# Altium project LightLink_V4.PrjPcb
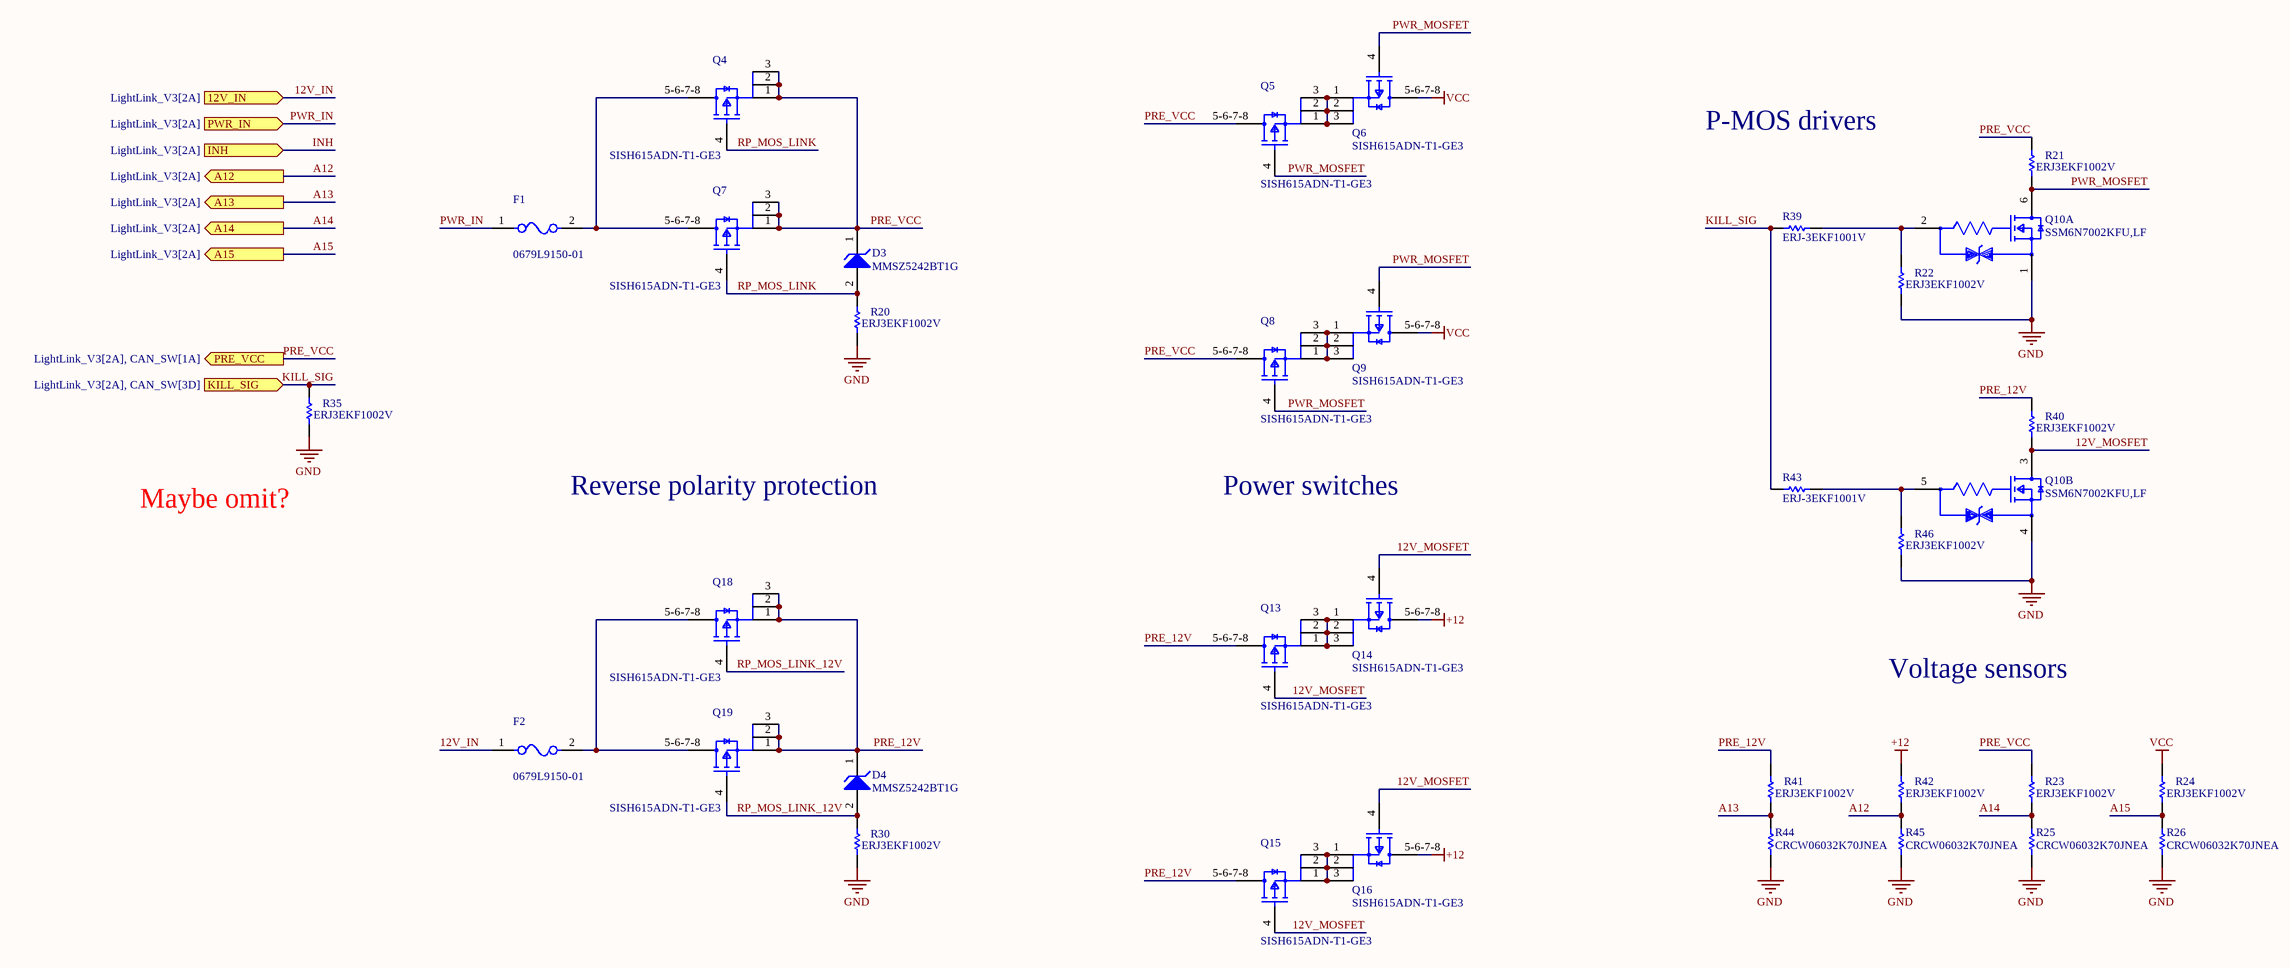
[diagram p0: PWR_MGMT.SchDoc]
1 sheet, 34 parts. Net scope: flat (ports and power ports of the same name join across sheets).
Board file: LightLink_V4.PcbDoc

## Sheet PWR_MGMT.SchDoc
size C; SheetNumber: 4; SheetTotal: 6

### Parts
D3  MMSZ5242BT1G  [ONSC-SOD-123-2-425-04_V]
D4  MMSZ5242BT1G  [ONSC-SOD-123-2-425-04_V]
F1  0679L9150-01  [FP-0679L-MFG]
F2  0679L9150-01  [FP-0679L-MFG]
Q4  SISH615ADN-T1-GE3  [SISH615ADN-T1-GE3-Footprint-1]
Q5  SISH615ADN-T1-GE3  [SISH615ADN-T1-GE3-Footprint-1]
Q6  SISH615ADN-T1-GE3  [SISH615ADN-T1-GE3-Footprint-1]
Q7  SISH615ADN-T1-GE3  [SISH615ADN-T1-GE3-Footprint-1]
Q8  SISH615ADN-T1-GE3  [SISH615ADN-T1-GE3-Footprint-1]
Q9  SISH615ADN-T1-GE3  [SISH615ADN-T1-GE3-Footprint-1]
Q10  SSM6N7002KFU,LF  [FP-SSOP6-P-0_65A-MFG]  (parts A,B of 2)
Q13  SISH615ADN-T1-GE3  [SISH615ADN-T1-GE3-Footprint-1]
Q14  SISH615ADN-T1-GE3  [SISH615ADN-T1-GE3-Footprint-1]
Q15  SISH615ADN-T1-GE3  [SISH615ADN-T1-GE3-Footprint-1]
Q16  SISH615ADN-T1-GE3  [SISH615ADN-T1-GE3-Footprint-1]
Q18  SISH615ADN-T1-GE3  [SISH615ADN-T1-GE3-Footprint-1]
Q19  SISH615ADN-T1-GE3  [SISH615ADN-T1-GE3-Footprint-1]
R20  ERJ3EKF1002V  [RESC1609X55X30LL15T15]
R21  ERJ3EKF1002V  [RESC1609X55X30LL15T15]
R22  ERJ3EKF1002V  [RESC1609X55X30LL15T15]
R23  ERJ3EKF1002V  [RESC1609X55X30LL15T15]
R24  ERJ3EKF1002V  [RESC1609X55X30LL15T15]
R25  CRCW06032K70JNEA  [RESC1609X50X30ML10T20]
R26  CRCW06032K70JNEA  [RESC1609X50X30ML10T20]
R30  ERJ3EKF1002V  [RESC1609X55X30LL15T15]
R35  ERJ3EKF1002V  [RESC1609X55X30LL15T15]
R39  ERJ-3EKF1001V  [RESC1608X55X30LL15T15]
R40  ERJ3EKF1002V  [RESC1609X55X30LL15T15]
R41  ERJ3EKF1002V  [RESC1609X55X30LL15T15]
R42  ERJ3EKF1002V  [RESC1609X55X30LL15T15]
R43  ERJ-3EKF1001V  [RESC1608X55X30LL15T15]
R44  CRCW06032K70JNEA  [RESC1609X50X30ML10T20]
R45  CRCW06032K70JNEA  [RESC1609X50X30ML10T20]
R46  ERJ3EKF1002V  [RESC1609X55X30LL15T15]

### Ports
12V_IN (in, see LightLink_V3[2A]), A12 (out, see LightLink_V3[2A]), A13 (out, see LightLink_V3[2A]), A14 (out, see LightLink_V3[2A]), A15 (out, see LightLink_V3[2A]), INH (in, see LightLink_V3[2A]), KILL_SIG (in, see LightLink_V3[2A], CAN_SW[3D]), PRE_VCC (out, see LightLink_V3[2A], CAN_SW[1A]), PWR_IN (in, see LightLink_V3[2A])

### Nets
+12: Q14.5-6-7-8(D) Q16.5-6-7-8(D) R42.1
GND: Q10.1(Source1) Q10.4(Source2) R20.2 R22.2 R25.1 R26.1 R30.2 R35.2 R44.1 R45.1 R46.2
VCC: Q6.5-6-7-8(D) Q9.5-6-7-8(D) R24.1
12V_IN: F2.1 ; port 12V_IN
12V_MOSFET: Q10.3(Drain2) Q13.4(G) Q14.4(G) Q15.4(G) Q16.4(G) R40.2
A12: R42.2 R45.2 ; port A12
A13: R41.2 R44.2 ; port A13
A14: R23.2 R25.2 ; port A14
A15: R24.2 R26.2 ; port A15
INH: port INH
KILL_SIG: R35.1 R39.1 R43.1 ; port KILL_SIG
PRE_12V: D4.1(K) Q13.5-6-7-8(D) Q15.5-6-7-8(D) Q18.1(S) Q18.2(S) Q18.3(S) Q19.1(S) Q19.2(S) Q19.3(S) R40.1 R41.1
PRE_VCC: D3.1(K) Q4.1(S) Q4.2(S) Q4.3(S) Q5.5-6-7-8(D) Q7.1(S) Q7.2(S) Q7.3(S) Q8.5-6-7-8(D) R21.1 R23.1 ; port PRE_VCC
PWR_IN: F1.1 ; port PWR_IN
PWR_MOSFET: Q5.4(G) Q6.4(G) Q8.4(G) Q9.4(G) Q10.6(Drain1) R21.2
RP_MOS_LINK: D3.2(A) Q4.4(G) Q7.4(G) R20.1
RP_MOS_LINK_12V: D4.2(A) Q18.4(G) Q19.4(G) R30.1
NetF1_2: F1.2 Q4.5-6-7-8(D) Q7.5-6-7-8(D)
NetF2_2: F2.2 Q18.5-6-7-8(D) Q19.5-6-7-8(D)
NetQ5_1: Q5.1(S) Q5.2(S) Q5.3(S) Q6.1(S) Q6.2(S) Q6.3(S)
NetQ8_1: Q8.1(S) Q8.2(S) Q8.3(S) Q9.1(S) Q9.2(S) Q9.3(S)
NetQ10_2: Q10.2(Gate1) R22.1 R39.2
NetQ10_5: Q10.5(Gate2) R43.2 R46.1
NetQ13_1: Q13.1(S) Q13.2(S) Q13.3(S) Q14.1(S) Q14.2(S) Q14.3(S)
NetQ15_1: Q15.1(S) Q15.2(S) Q15.3(S) Q16.1(S) Q16.2(S) Q16.3(S)

### Notes on the sheet
- P-MOS drivers
- Maybe omit?
- Reverse polarity protection
- Power switches
- Voltage sensors

### Library data of the parts
D3 D4 = CMP-1060-00565-1: Zener Voltage Regulator, 500 mW, 2-Pin SOD-123, Pb-Free, Tape and Reel; Manufacturer: On Semiconductor; P Max (W): 0.5; VZ Typ (V): 12; PartNumber: MMSZ5242BT1G; PackageReference: SOD-123-2-425-04; ComponentLink3URL: http://www.onsemi.com/pub_link/Collateral/425-04.PDF; Mounting Technology: Surface Mount; ComponentLink2Description: Datasheet; ComponentLink1URL: http://www.onsemi.com/; ComponentLink3Description: Package Specification; PackageDescription: 2-Pin SOD, Body 1.6 x 2.69 mm; PackageVersion: Rev. G, 10/2009; ComponentLink1Description: Manufacturer URL; RoHS: Pb-Free; ComponentLink2URL: http://www.onsemi.com/pub_link/Collateral/MMSZ5221BT1-D.PDF; Packing: Tape and Reel; DatasheetVersion: Rev. 12
F1 F2 = CMP-16042-000002-1: FUSE BRD MNT 15A 125VAC/VDC; Manufacturer: Bel Fuse; Max Fuse Ac Voltage: 125V; Fuse Blow Speed: Fast; Fuse I2T: 103.5A2Sec; Fuse Interrupt Ac Current: 50A; Automotive Grade: Grade 1; Value: 0.0038Ω; Fuse Interrupt Dc Current: 300A; Fuse Voltage Drop: 0.13V; Device Class L2: Fuses; ComponentLink2URL: https://www.belfuse.com/resources/CircuitProtection/datasheets/0679L%20Sep2016.pdf; Package: 0679L; Height: 2.79mm; Digikey Description: FUSE BRD MNT 15A 125VAC/VDC; Temperature Range High: +125°C; Device Class L3: unset; Octopart: https://octopart.com/0679l9150-01-bel+fuse-70850665; Temperature Range Low: -55°C; Fuse Current: 15A; Max Fuse Dc Voltage: 125V; Ipc Land Pattern Name: CAPC610254X254; Manufacturer Part Number: 0679L9150-01; Category: Fuse; Lead Free: Yes; Automotive: Yes; Resistance: 0.0038Ω; RoHS: TRUE; Device Class L1: Circuit Protection; ComponentLink2Description: Datasheet; Temperature: -55°C to +125°C; Voltage Rating: 125V
Q4-Q9 Q13-Q16 Q18 Q19 = CMP-013-00036-2: Trans MOSFET P-CH 20V 22.1A 8-Pin PowerPAK 1212 EP T/R
Q10 = CMP-35916-000009-1: MOSFET 2N-CH 60V 0.3A; Input Capacitance: 40pF; Continuous Drain Current (ID): 300mA; Max Power Dissipation: 285mW; FET Type: 2 N-Channel; Rds On Max: 1.5R; Mount: Surface Mount; Drain to Source Voltage (Vdss): 60V; Packaging: Tape and Reel
R20-R24 R30 R35 R40-R42 R46 = CMP-1012-00623-3: Chip Resistor, 10 KOhm, +/- 1%, 0.1 W, -55 to 155 degC, 0603 (1608 Metric), RoHS, Tape and Reel; Manufacturer: Panasonic; Voltage Rating: 75V; Case\/Package: 0603; Power Rating: 100mW; Resistance: 10KOhm; Temperature Coefficient: 100ppm\/degreesC; Number of Pins: 2; Package Reference: 603; Depth: 0.8mm; Mount: SurfaceMount; Package Description: 2-Pin Surface Mount Device, Body 1.6 x 0.85 mm; Datasheet Version: 02/2017; Length: 1.6mm; Lead Free: LeadFree; Height: 0.45mm; Number of Terminations: 2; Max Power Dissipation: 100mW; Min Operating Temperature: -55degC; Datasheet URL: https://industrial.panasonic.com/cdbs/www-data/pdf/RDA0000/AOA0000C304.pdf; Termination: SMD/SMT; Case Code (Metric): 1608; Case Code (Imperial): 0603; Tolerance: 1%; Max Operating Temperature: 155degC; RoHSCompliant: true; Voltage Rating (DC): 75V; Radiation Hardening: No; Packaging: TapeandReel; Composition: ThickFilm; Mounting Technology: SurfaceMount; Manufacturer URL: http://www.panasonic.com/; Width: 0.031inch; REACH SVHC: NoSVHC; Contact Plating: Tin; Military Standard: Not; Package Quantity: 1
R25 R26 R44 R45 = CMP-2000-03183-1: Manufacturer: Vishay Dale; Part Number: CRCW06032K70JNEA
R39 R43 = CMP-2000-00180-1: Manufacturer: Panasonic; Part Number: ERJ-3EKF1001V